# EAGLE schematic A1200_USB_Teensy (EAGLE 6.5.0)
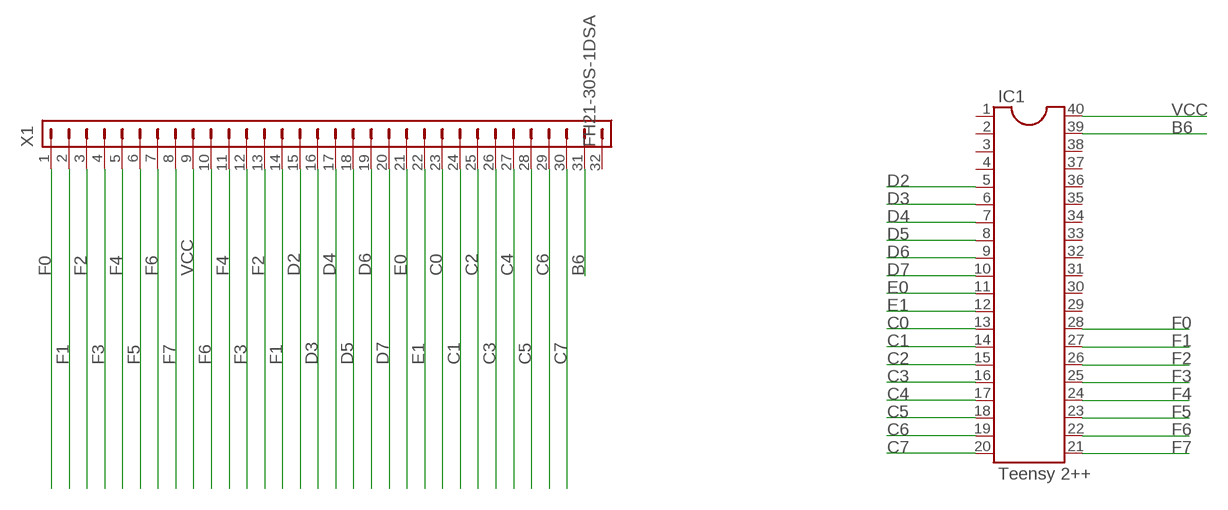
[diagram p0: schematic, sheet 1]

## Parts
IC1  Teensy 2++  DIL40  [DIL40]
X1  FH21-30S-1DSA  [FH21-30S-1DSA]

## Nets
B6: IC1.39 X1.31
C0: IC1.13 X1.23
C1: IC1.14 X1.24
C2: IC1.15 X1.25
C3: IC1.16 X1.26
C4: IC1.17 X1.27
C5: IC1.18 X1.28
C6: IC1.19 X1.29
C7: IC1.20 X1.30
D2: IC1.5 X1.15
D3: IC1.6 X1.16
D4: IC1.7 X1.17
D5: IC1.8 X1.18
D6: IC1.9 X1.19
D7: IC1.10 X1.20
E0: IC1.11 X1.21
E1: IC1.12 X1.22
F0: IC1.28 X1.1
F1: IC1.27 X1.2 X1.14
F2: IC1.26 X1.3 X1.13
F3: IC1.25 X1.4 X1.12
F4: IC1.24 X1.5 X1.11
F5: IC1.23 X1.6
F6: IC1.22 X1.7 X1.10
F7: IC1.21 X1.8
VCC: IC1.40 X1.9
Unconnected: IC1.1 IC1.2 IC1.3 IC1.4 IC1.29 IC1.30 IC1.31 IC1.32 IC1.33 IC1.34 IC1.35 IC1.36 IC1.37 IC1.38 X1.32

## Library data of the parts
IC1 = ic-package:DIL40: Dual In Line
X1 = con-hirose:FH21-30S-1DSA: FPC CONNECTOR Source: con-hirose.lbr from Bob Starr <rtzaudio@mindspring.com>; OC_FARNELL: unknown; OC_NEWARK: unknown